# Altium project Hydrophones_FrontEnd_Module_2.PrjPcb
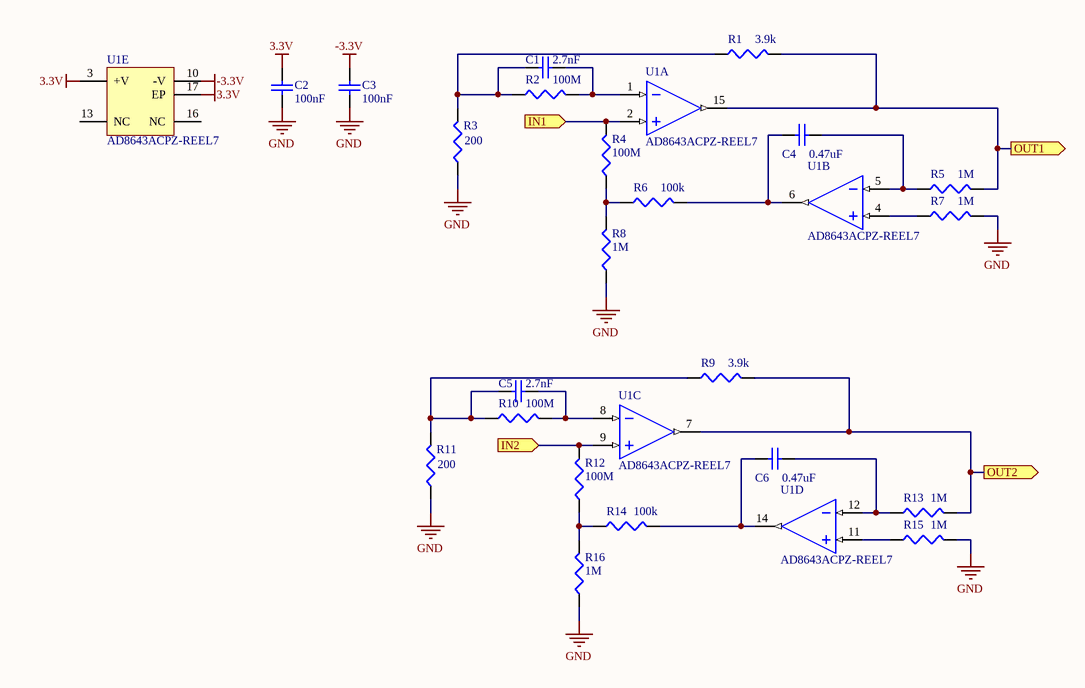
[diagram p0: Channels.SchDoc]
1 sheet, 23 parts. Net scope: flat (ports and power ports of the same name join across sheets).
Board file: Channels.PcbDoc

## Sheet Channels.SchDoc
size A

### Parts
C1  value 2.7nF  [0201]  (hidden comment: Cap Semi)
C2  value 100nF  [0201]  (hidden comment: Cap Semi)
C3  value 100nF  [0201]  (hidden comment: Cap Semi)
C4  value 0.47uF  [0402]  (hidden comment: Cap Semi)
C5  value 2.7nF  [0201]  (hidden comment: Cap Semi)
C6  value 0.47uF  [0402]  (hidden comment: Cap Semi)
R1  value 3.9k  [01005]  (hidden comment: Res3)
R2  value 100M  [01005]  (hidden comment: Res3)
R3  value 200  [01005]  (hidden comment: Res3)
R4  value 100M  [0402]  (hidden comment: Res3)
R5  value 1M  [01005]  (hidden comment: Res3)
R6  value 100k  [01005]  (hidden comment: Res3)
R7  value 1M  [01005]  (hidden comment: Res3)
R8  value 1M  [01005]  (hidden comment: Res3)
R9  value 3.9k  [01005]  (hidden comment: Res3)
R10  value 100M  [01005]  (hidden comment: Res3)
R11  value 200  [01005]  (hidden comment: Res3)
R12  value 100M  [0402]  (hidden comment: Res3)
R13  value 1M  [01005]  (hidden comment: Res3)
R14  value 100k  [01005]  (hidden comment: Res3)
R15  value 1M  [01005]  (hidden comment: Res3)
R16  value 1M  [01005]  (hidden comment: Res3)
U1  AD8643ACPZ-REEL7  [ADI-CP-16-3_N]  (parts A,B,C,D,E of 5)

### Ports
IN1 (in), IN2 (in), OUT1 (out), OUT2 (out)

### Nets
3.3V: C2.2 U1.3(+V) U1.17(EP)
-3.3V: C3.2 U1.10(-V)
GND: C2.1 C3.1 R3.1 R7.2 R8.1 R11.1 R15.2 R16.1
NetC1_1: C1.1 R1.1 R2.1 R3.2
NetC1_2: C1.2 R2.2 U1.1(-IN_A)
NetC4_1: C4.1 R6.2 U1.6(OUT_B)
NetC4_2: C4.2 R5.1 U1.5(-IN_B)
NetC5_1: C5.1 R9.1 R10.1 R11.2
NetC5_2: C5.2 R10.2 U1.8(-IN_C)
NetC6_1: C6.1 R14.2 U1.14(OUT_D)
NetC6_2: C6.2 R13.1 U1.12(-IN_D)
NetR1_2: R1.2 R5.2 U1.15(OUT_A) ; port OUT1
NetR4_1: R4.1 R6.1 R8.2
NetR4_2: R4.2 U1.2(+IN_A) ; port IN1
NetR7_1: R7.1 U1.4(+IN_B)
NetR9_2: R9.2 R13.2 U1.7(OUT_C) ; port OUT2
NetR12_1: R12.1 R14.1 R16.2
NetR12_2: R12.2 U1.9(+IN_C) ; port IN2
NetR15_1: R15.1 U1.11(+IN_D)

Not connected (* = marked no-connect by the designer): U1 13(NC) 16(NC)

### Library data of the parts
C1-C6 = Cap Semi: Capacitor (Semiconductor SIM Model); Published: 8-Jun-2000; LatestRevisionDate: 29-May-2009; LatestRevisionNote: IPC-7351 Footprint Added.; PackageReference: C1206; Publisher: Altium Limited; PackageDescription: Chip Capacitor
R1-R16 = Res3: Resistor; Published: 8-Jun-2000; LatestRevisionDate: 29-May-2009; LatestRevisionNote: IPC-7351 Footprint Added.; PackageReference: J1-0603; Publisher: Altium Limited; PackageDescription: Chip Resistor
U1 = AD8643ACPZ-REEL7: Quad Channel Very Low Input Bias Current Operational Amplifier, 3.5 MHz BW, 3 V/us SR, Industrial, 16-pin QFN (CP-16-3), Reel; Generic Part Number: AD8643; Manufacturer: Analog Devices; Amplifiers Per Package: 4; Input Bias Current: 250fA; Input Offset Voltage: 50uV; Iq/Amp: 290uA; Slew Rate: 3V/us; Small Signal Bandwidth: 3.5MHz; V Span Max: 26V; V Span Min: 5V; DatasheetVersion: Rev. E; PackageReference: CP-16-3; PackageDescription: 16-Pin Lead Frame Chip Scale Package, Body 3 x 3 mm, Pitch 0.5 mm; Supplier 1: Digi-Key; Supplier Part Number 1: AD8643ACPZ-REEL7TR-ND; Supplier 2: Digi-Key; Supplier Part Number 2: AD8643ACPZ-REEL7CT-ND; Supplier 3: Digi-Key; Supplier Part Number 3: AD8643ACPZ-REEL7DKR-ND; Supplier 4: Newark; Supplier Part Number 4: 59K7031; Mounting Technology: Surface Mount; Code_JEDEC: MO-220-VEED-2; PartNumber: AD8643ACPZ-REEL7; ComponentLink1Description: Manufacturer URL; ComponentLink1URL: http://www.analog.com/en/index.html; ComponentLink2Description: Datasheet; ComponentLink2URL: http://www.analog.com/static/imported-files/data_sheets/AD8641_8642_8643.pdf; ComponentLink3Description: Package Specification; ComponentLink3URL: http://www.analog.com/static/imported-files/packages/PKG_PDF/LFCSP(CP)/CP_16_3.pdf